# EasyEDA schematic SmartLightHub.json
TITLE: Light Hub; REV: 1.0; Date: 2021-10-09; Sheet: 1/1; Drawn By: VictorAlicino; Company: SmartOffice
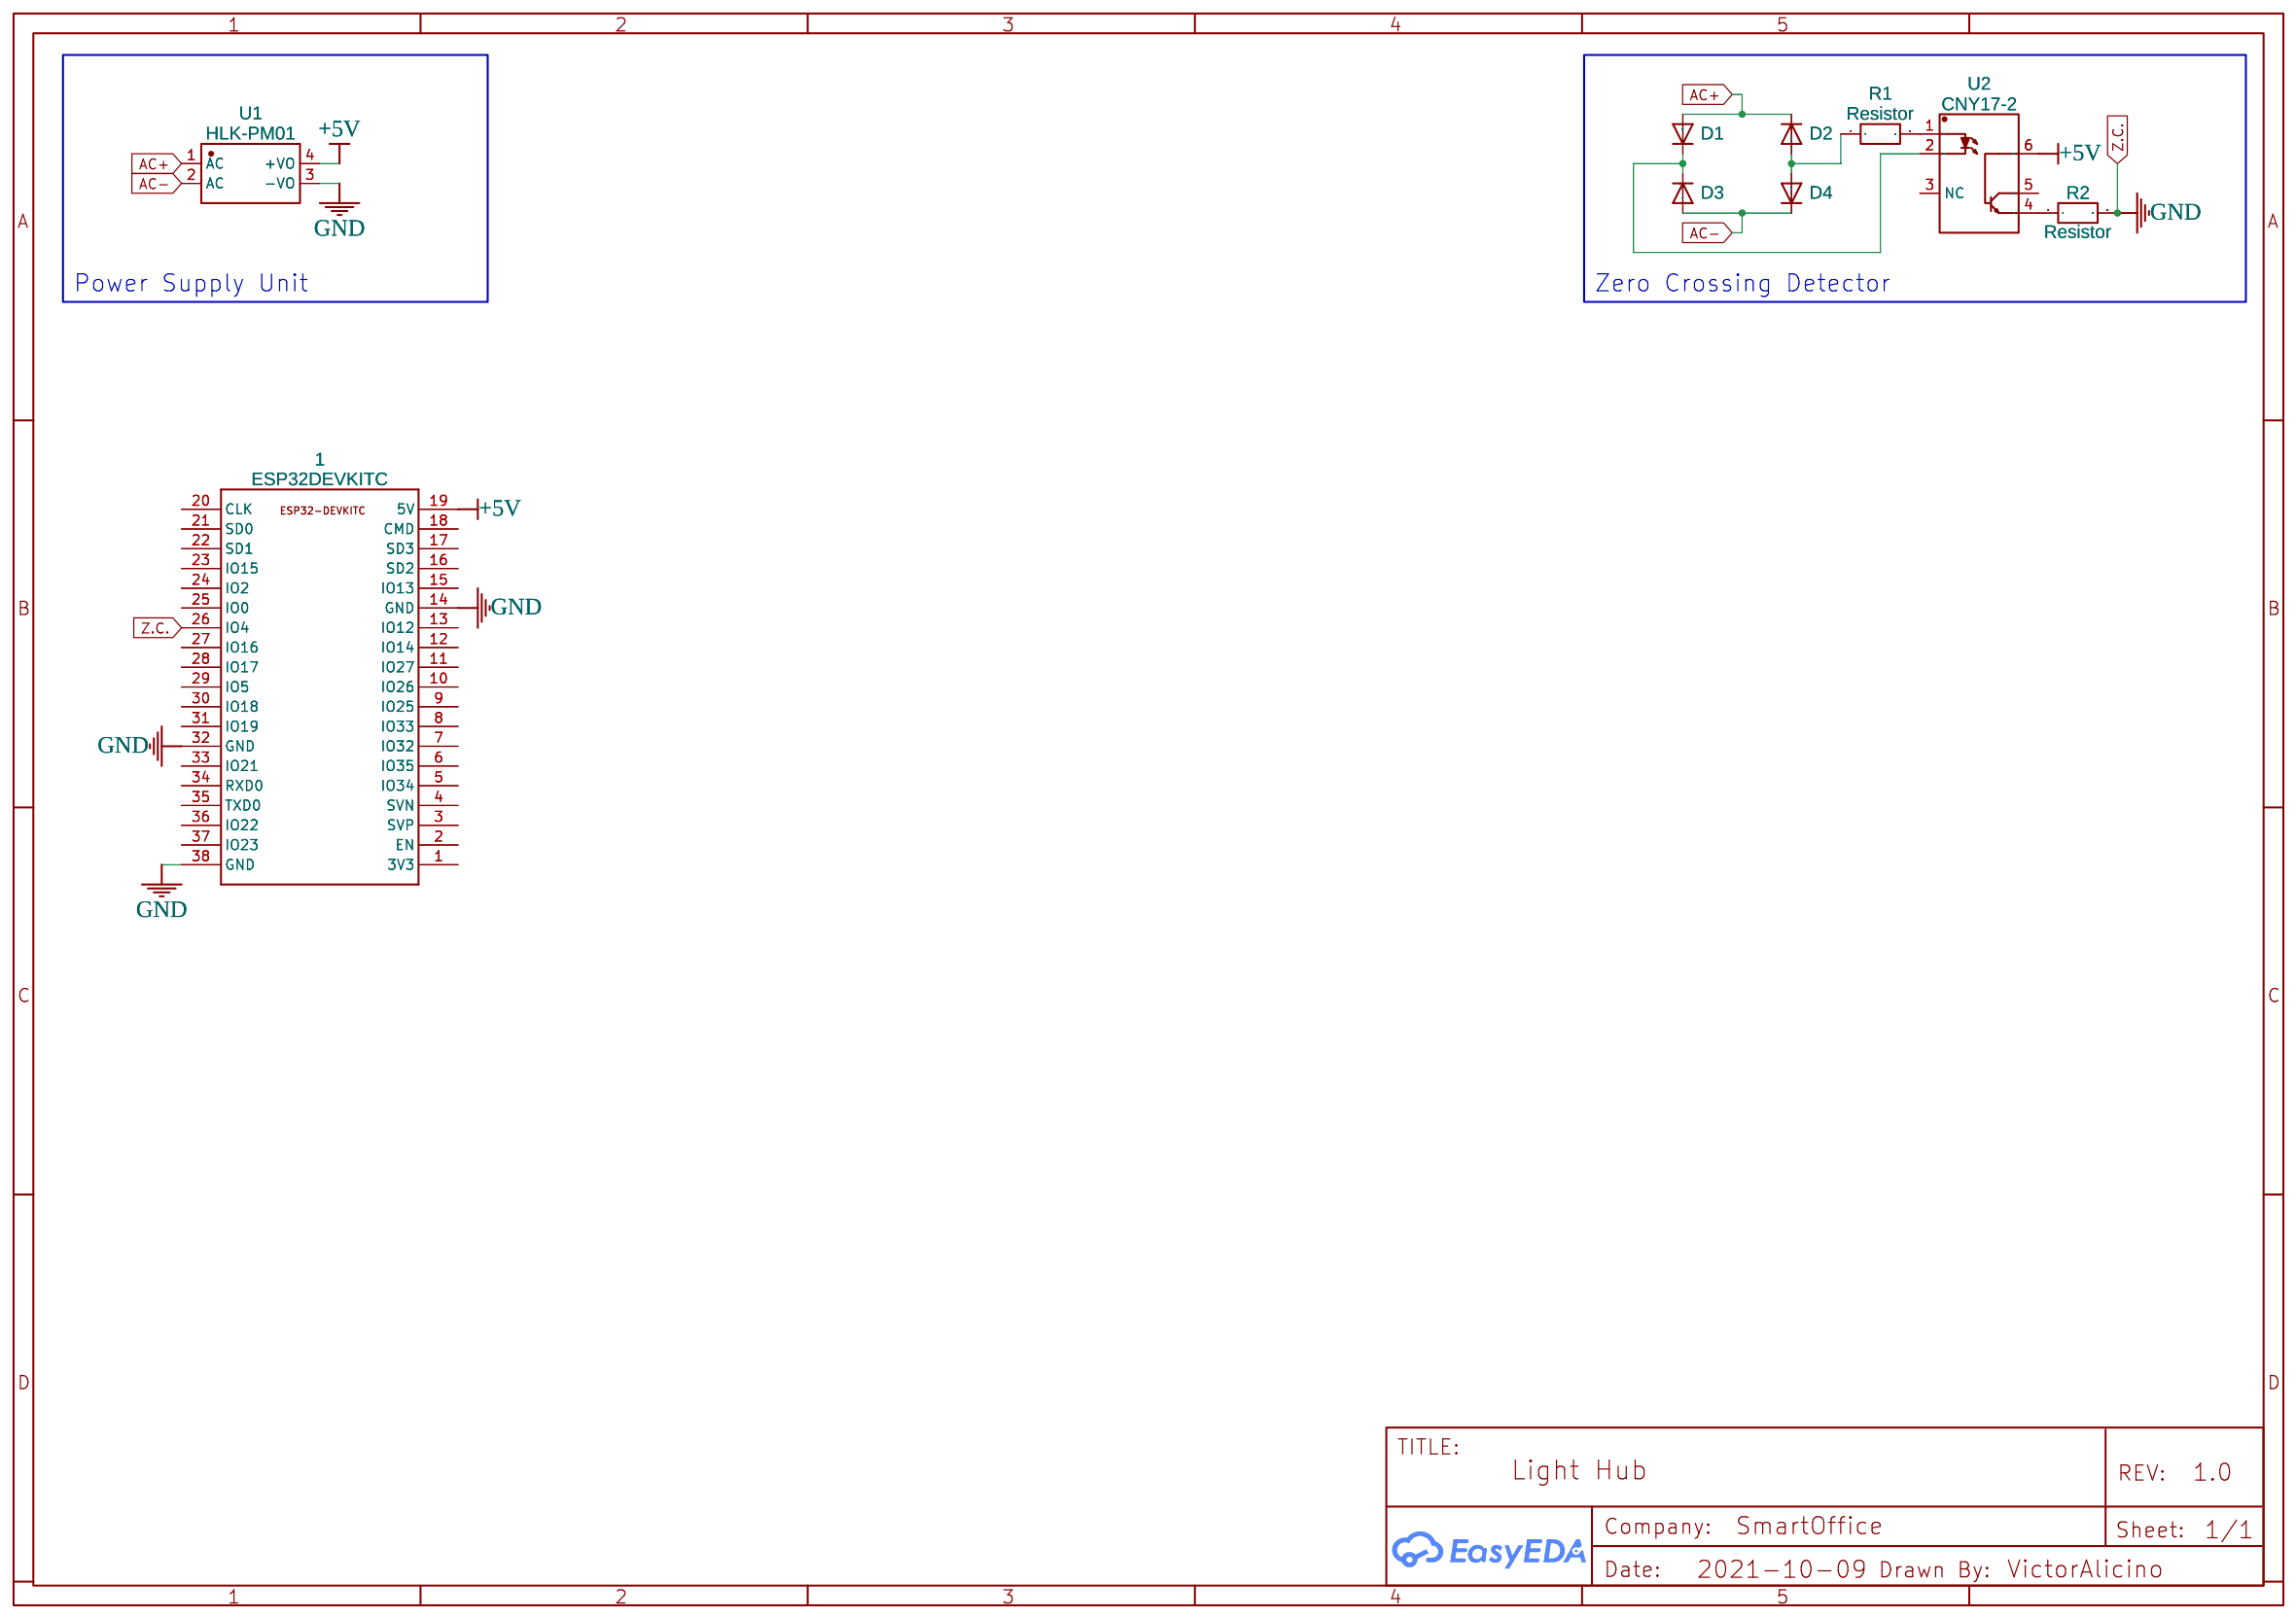
[diagram p0: schematic sheet]

## Parts
1  ESP32DEVKITC  [ESP32-DEVKITC]
D1  DIODE  [DIODE-1N4001]
D2  DIODE  [DIODE-1N4001]
D3  DIODE  [DIODE-1N4001]
D4  DIODE  [DIODE-1N4001]
R1  Resistor  [AXIAL-0.3]
R2  Resistor  [AXIAL-0.3]
U1  HLK-PM01  [PWRM-TH_HLK-PM01]
U2  CNY17-2  [DIP-6_L7.3-W6.5-P2.54-LS7.6-BL]

## Library data of the parts
1 = ESP32DEVKITC: Contributor: Jan “Alpi” Mannsbart
D1-D4 = DIODE: Contributor: SparkFun
R1 = Resistor1_EU: Contributor: EasyEDA; Resistance: 2.2K; sim: true
R2 = Resistor1_EU: Contributor: EasyEDA; Resistance: 1K; sim: true
U1 = HLK-PM01: Supplier: LCSC; Supplier Part: C209903; Manufacturer: HI-LINK; Contributor: LCSC; JLCPCB Part Class: Extended Part
U2 = CNY17-2: Supplier: LCSC; Manufacturer: LITEON; Supplier Part: C10807; JLCPCB Part Class: Extended Part

## Nets
+5V: 1.19(5V) U1.4(+VO) U2.6(BASE)
GND: 1.14(GND) 1.26(IO4) 1.32(GND) 1.38(GND) R2.2 U1.3(-VO)
AC+: D1.A D2.C U1.1(AC)
AC-: D3.A D4.C U1.2(AC)
Net-(D1-C): D1.C D3.C U2.2
Net-(D2-A): D2.A D4.A R1.1
Net-(R1-2): R1.2 U2.1
Net-(R2-1): R2.1 U2.4(E)

Not connected (* = marked no-connect by the designer): 1 1(3V3) 2(EN) 3(SVP) 4(SVN) 5(IO34) 6(IO35) 7(IO32) 8(IO33) 9(IO25) 10(IO26) 11(IO27) 12(IO14) 13(IO12) 15(IO13) 16(SD2) 17(SD3) 18(CMD) 20(CLK) 21(SD0) 22(SD1) 23(IO15) 24(IO2) 25(IO0) 27(IO16) 28(IO17) 29(IO5) 30(IO18) 31(IO19) 33(IO21) 34(RXD0) 35(TXD0) 36(IO22) 37(IO23); U2 3(NC) 5(C)

## Notes on the sheet
- Power Supply Unit
- Zero Crossing Detector
